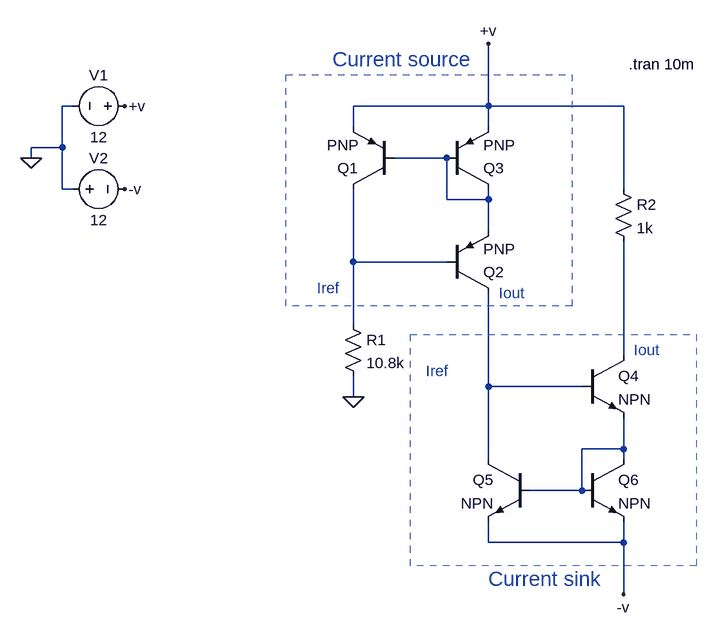
[diagram p0: schematic Draft15.asc]
Draft15.asc, the LTspice schematic file:
Version 4
SHEET 1 948 888
WIRE -192 80 -208 80
WIRE 448 80 448 -16
WIRE 448 80 240 80
WIRE 656 80 448 80
WIRE 240 112 240 80
WIRE 448 112 448 80
WIRE -208 144 -208 80
WIRE -208 144 -256 144
WIRE -256 160 -256 144
WIRE 384 160 304 160
WIRE -208 208 -208 144
WIRE -192 208 -208 208
WIRE 656 208 656 80
WIRE 384 224 384 160
WIRE 448 224 448 208
WIRE 448 224 384 224
WIRE 448 272 448 224
WIRE 240 320 240 208
WIRE 384 320 240 320
WIRE 240 416 240 320
WIRE 656 464 656 288
WIRE 448 512 448 368
WIRE 592 512 448 512
WIRE 240 528 240 496
WIRE 656 608 656 560
WIRE 656 608 592 608
WIRE 448 624 448 512
WIRE 656 624 656 608
WIRE 592 672 592 608
WIRE 592 672 512 672
WIRE 448 752 448 720
WIRE 656 752 656 720
WIRE 656 752 448 752
WIRE 656 832 656 752
FLAG 656 832 -v
FLAG -256 160 0
FLAG -112 80 +v
FLAG -112 208 -v
FLAG 448 -16 +v
FLAG 240 528 0
SYMBOL pnp 304 208 R180
SYMATTR InstName Q1
SYMBOL pnp 384 368 M180
SYMATTR InstName Q2
SYMBOL pnp 384 208 M180
SYMATTR InstName Q3
SYMBOL npn 592 464 R0
SYMATTR InstName Q4
SYMBOL npn 512 624 M0
SYMATTR InstName Q5
SYMBOL npn 592 624 R0
SYMATTR InstName Q6
SYMBOL voltage -96 80 R90
WINDOW 0 -32 56 VBottom 2
WINDOW 3 32 56 VTop 2
SYMATTR InstName V1
SYMATTR Value 12
SYMBOL voltage -208 208 R270
WINDOW 0 32 56 VTop 2
WINDOW 3 -32 56 VBottom 2
SYMATTR InstName V2
SYMATTR Value 12
SYMBOL res 224 400 R0
SYMATTR InstName R1
SYMATTR Value 10.8k
SYMBOL res 640 192 R0
SYMATTR InstName R2
SYMATTR Value 1k
TEXT 208 8 Left 3 ;Current source
TEXT 184 360 Left 2 ;Iref
TEXT 464 368 Left 2 ;Iout
TEXT 448 808 Left 3 ;Current sink
TEXT 352 488 Left 2 ;Iref
TEXT 672 456 Left 2 ;Iout
TEXT 664 16 Left 2 !.tran 10m
RECTANGLE Normal 136 32 576 388 2
RECTANGLE Normal 328 432 768 788 2

The netlist it stands for:
* Draft15.asc
Q1 N002 N001 +v 0 PNP
Q2 N004 N002 N001 0 PNP
Q3 N001 N001 +v 0 PNP
Q4 N003 N004 N005 0 NPN
Q5 N004 N005 -v 0 NPN
Q6 N005 N005 -v 0 NPN
V1 +v 0 12
V2 0 -v 12
R1 N002 0 10.8k
R2 +v N003 1k
.model NPN NPN
.model PNP PNP
.lib standard.bjt
* Current source
* Iref
* Iout
* Current sink
* Iref
* Iout
.tran 10m
.backanno
.end